# EAGLE design schematic (EAGLE 9.6.2)
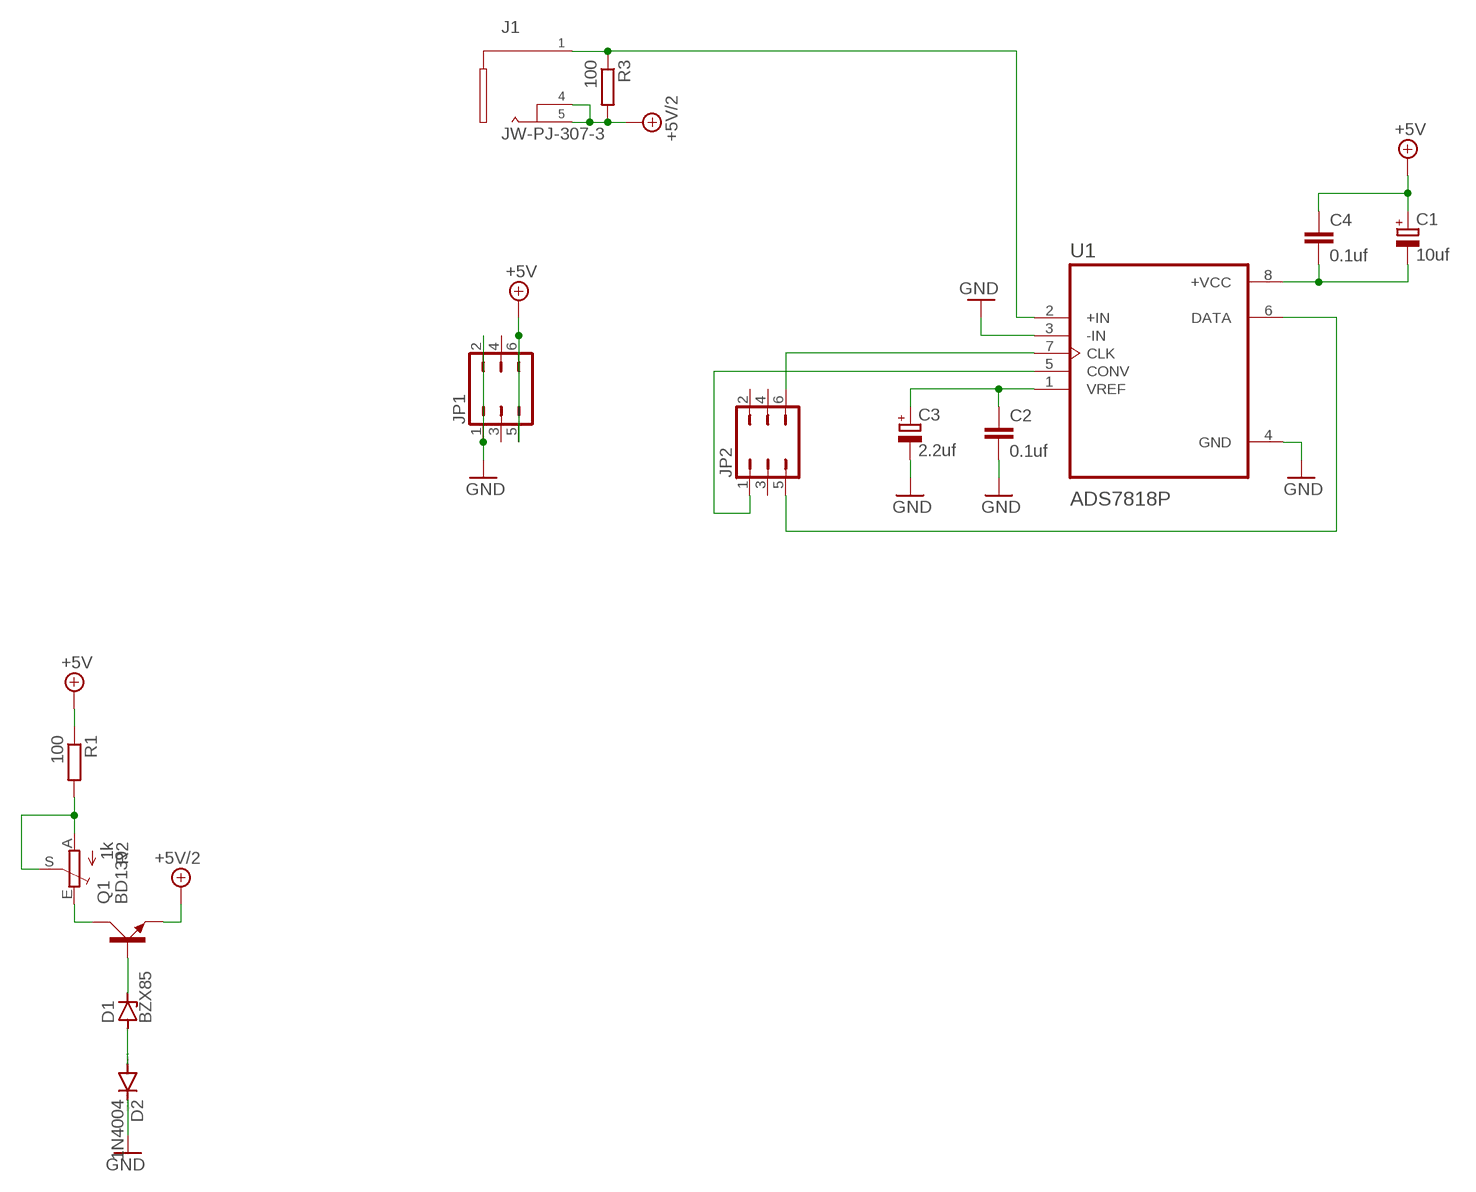
[diagram p0: schematic, sheet 1]

## Parts
C1  10uf  CPOL-EUE3.5-8  [E3,5-8]
C2  0.1uf  C-EU050-030X075  [C050-030X075]
C3  2.2uf  CPOL-EUE2.5-6  [E2,5-6]
C4  0.1uf  C-EU050-030X075  [C050-030X075]
D1  BZX85  [DO41Z10]
D2  1N4004  [DO41-10]
J1  JW-PJ-307-3  [JW-PJ-307-X]
JP1  JP3Q  [JP3Q]
JP2  JP3Q  [JP3Q]
Q1  BD139  [TO126AV]
R1  100  R-EU_0207/10  [0207/10]
R2  1k  TRIM_EU-CA9V  [CA9V]
R3  100  R-EU_0207/10  [0207/10]
U1  ADS7818P  [DIP794W45P254L959H508Q8]

## Nets
+5V: C1.+ C4.1 JP1.5 JP1.6 R1.1
+5V/2: J1.P$4 J1.P$5 Q1.E R3.2
GND: C2.2 C3.- D2.C JP1.1 JP1.2 U1.3(-IN) U1.4(GND)
N$1: R1.2 R2.A R2.S
N$2: D1.A D2.A
N$3: D1.C Q1.B
N$4: Q1.C R2.E
N$5: JP2.6 U1.7(CLK)
N$6: J1.P$1 R3.1 U1.2(+IN)
N$7: JP2.1 U1.5(CONV)
N$8: C2.1 C3.+ U1.1(VREF)
N$9: JP2.5 U1.6(DATA)
N$10: C1.- C4.2 U1.8(+VCC)
Unconnected: JP1.3 JP1.4 JP2.2 JP2.3 JP2.4

## Library data of the parts
C1 C3 = rcl:CPOL-EU: POLARIZED CAPACITOR, European symbol; SPICEPREFIX: C
C2 C4 = rcl:C-EU: CAPACITOR, European symbol; SPICEPREFIX: C
D1 = diode:BZX85: Z DIODE
D2 = diode:1N4004: DIODE general purpose rectifier, 1 A
J1 = audioconn:JW-PJ-307-3
JP1 JP2 = jumper:JP3Q: JUMPER
Q1 = transistor-power:BD139: NPN TRANSISTOR
R1 R3 = rcl:R-EU_: RESISTOR, European symbol; SPICEPREFIX: R
R2 = pot:TRIM_EU-: POTENTIOMETER
U1 = ADS7818P:ADS7818P: Check prices <https://pricing.snapeda.com/parts/ADS7818P/Texas%20Instruments/view-part?ref=eda>; AVAILABILITY: Warning; DESCRIPTION: 12-Bit High Speed Low Power Sampling Analog-to-Digital Converter; MF: Texas Instruments; MP: ADS7818P; PACKAGE: PDIP-8 Texas; PRICE: None; PURCHASE-URL: https://pricing.snapeda.com/search/part/ADS7818P/?ref=eda

## Board
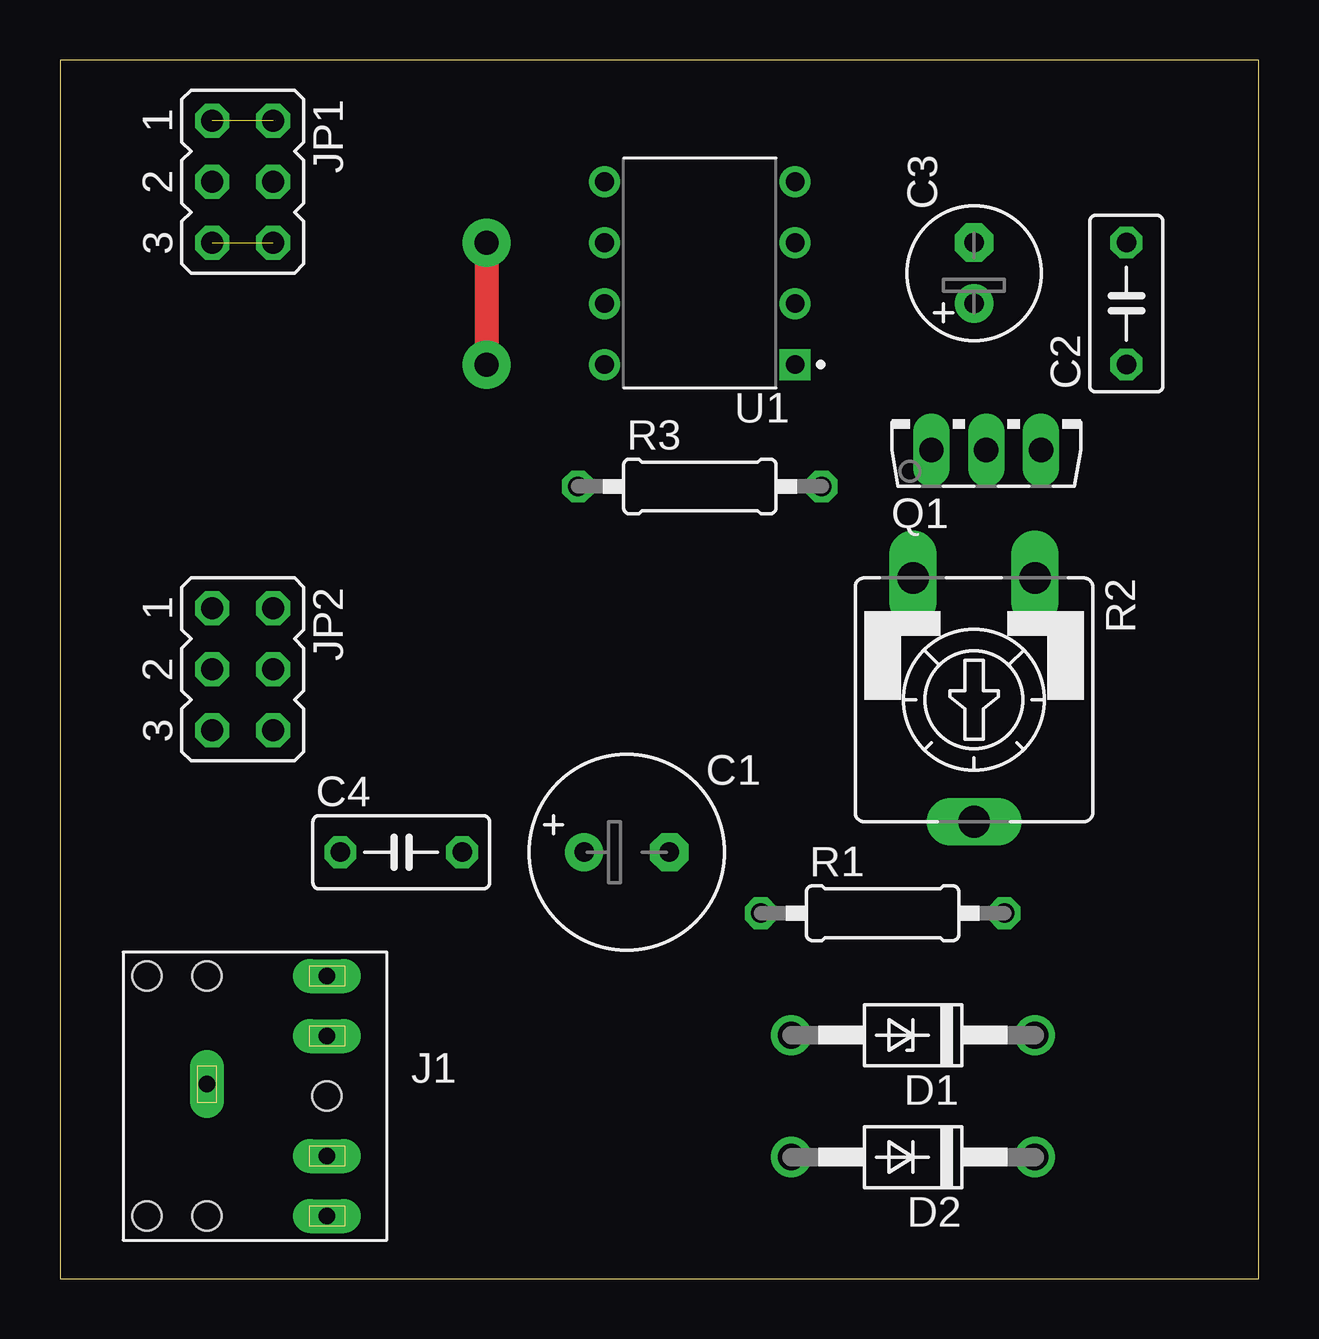
[diagram p1: board, top side]
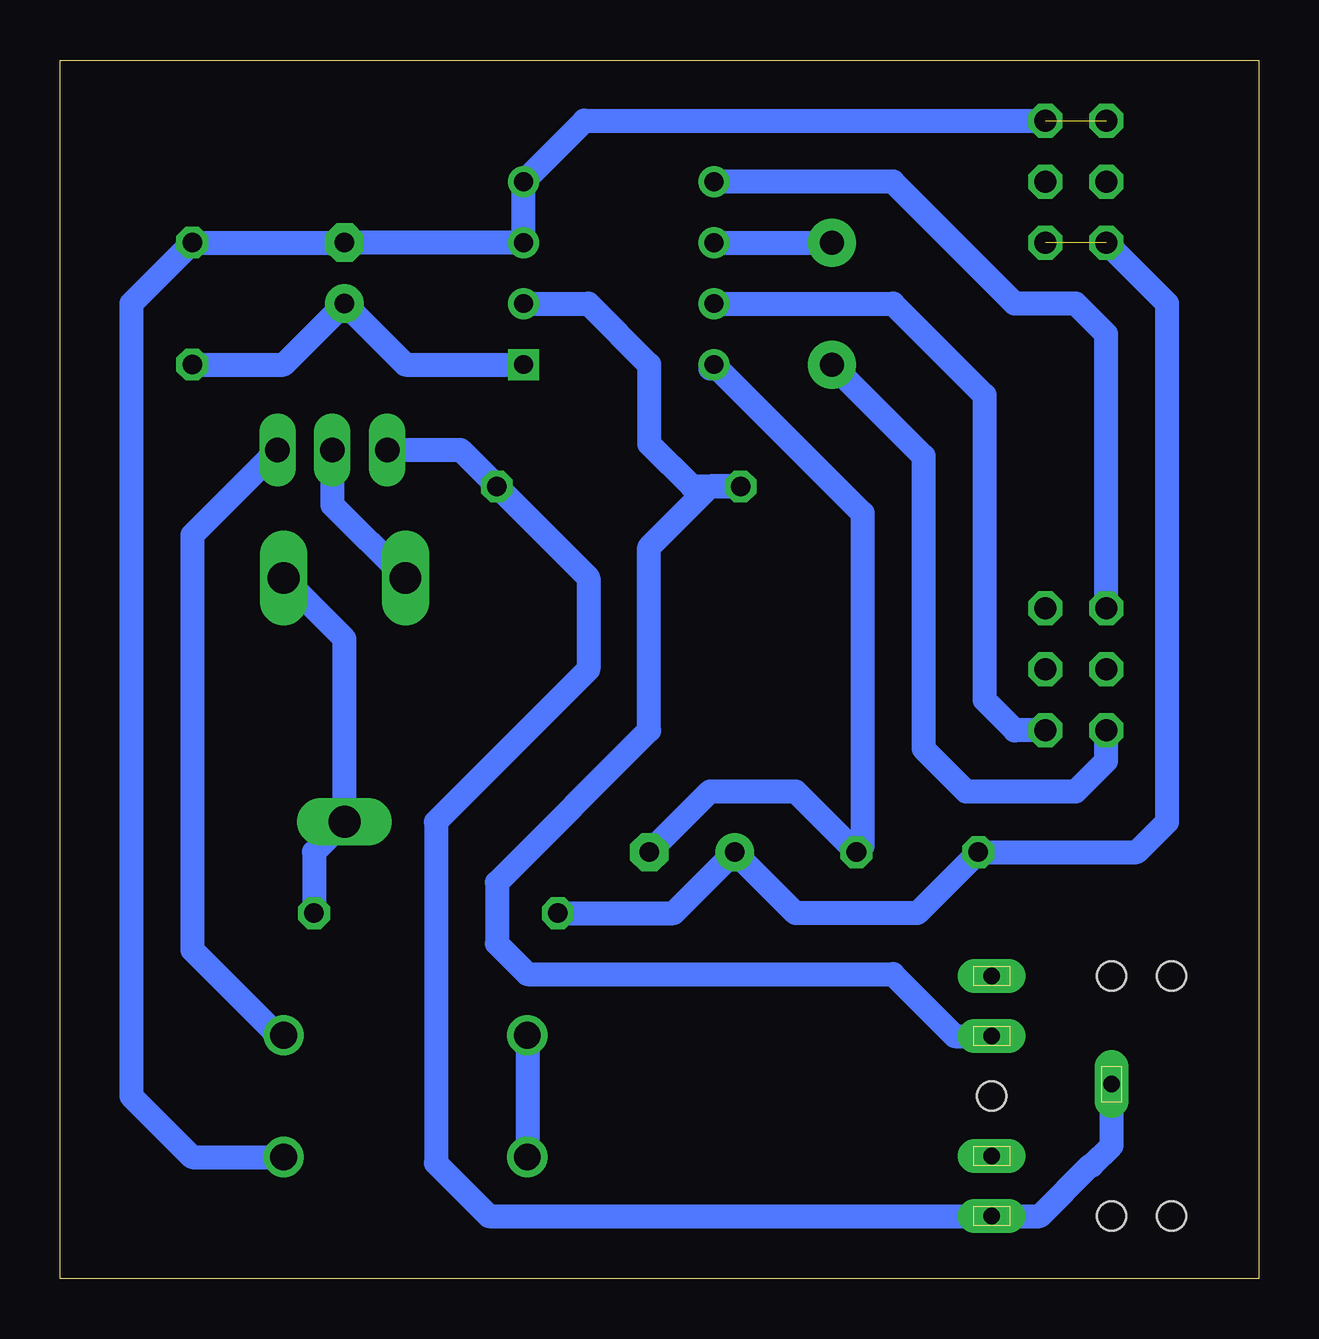
[diagram p2: board, bottom side, seen from below]

Size 49.96 x 50.79 mm. Coordinates in mm from the lower left corner, seen from the top.
Outline: 0,0 49.96,0 49.96,50.79 0,50.79 0,0
Copper layers (1*16): Top 0.035mm / dielectric 1.5mm / Bottom 0.035mm
Design rules "default": minimum track width 6mil, minimum drill 0.35mm, track to track 6mil, track to pad 6mil, pad to pad 6mil, via to via 6mil, smd to smd 6mil, copper to edge 40mil, drill to drill 6mil, minimum pad ring 10mil, minimum via ring 8mil, stop-mask expansion 4mil, vias tented up to drill 0mil, thermal gap 10mil

### Footprints (pad centres in the part's own frame; a part is rotated, then mirrored left to right if it is on the bottom)
E3,5-8 = drill 0.813 pad 1.6: + -1.778,0 | drill 0.813 pad 1.6 octagon: - 1.778,0
C050-030X075 = drill 0.813 octagon: 1 -2.54,0; 2 2.54,0
E2,5-6 = drill 0.813 pad 1.6: + -1.27,0 | drill 0.813 pad 1.6 octagon: - 1.27,0
DO41Z10 = drill 1.118: A 5.08,0; C -5.08,0
DO41-10 = drill 1.118: A 5.08,0; C -5.08,0
JW-PJ-307-X = drill 0.7 pad 1.422 long: P$1 3,2.5; P$2 3,5; P$3 3,-2.5; P$4 3,-5; P$5 -2,0.5 | hole 1.2: -4.5,5; -2,5; 3,0; -4.5,-5; -2,-5
JP3Q = drill 0.914 octagon: 1 -2.54,-1.27; 2 -2.54,1.27; 3 0,-1.27; 4 0,1.27; 5 2.54,-1.27; 6 2.54,1.27
TO126AV = drill 1.016 long: B 2.286,-1.27; C 0,-1.27; E -2.286,-1.27
0207/10 = drill 0.813 octagon: 1 -5.08,0; 2 5.08,0
CA9V = drill 1.321 long: A -2.54,-5.08; E 2.54,-5.08; S 0,5.08
DIP794W45P254L959H508Q8 = drill 0.78 pad 1.13 square: 1 -3.97,3.81 | drill 0.78 pad 1.13: 2 -3.97,1.27; 3 -3.97,-1.27; 4 -3.97,-3.81; 5 3.97,-3.81; 6 3.97,-1.27; 7 3.97,1.27; 8 3.97,3.81

### Placement (x,y rotation side)
C1  23.62,17.78 0 top
C2  44.45,40.64 90 top
C3  38.1,41.91 90 top
C4  14.22,17.78 0 top
D1  35.56,10.16 180 top
D2  35.56,5.08 180 top
J1  8.13,7.62 0 top
JP1  7.62,45.72 270 top
JP2  7.62,25.4 270 top
Q1  38.61,35.81 0 top
R1  34.29,15.24 0 top
R2  38.1,24.13 180 top
R3  26.67,33.02 0 top
U1  26.67,41.91 180 top

### Tracks (layer width: path | path; a pad name or v marks a point on that pad's centre or on a via)
+5V  (1 unrouted)
  Bottom 1: JP1.5 3.81,40.64 3.81,19.05 5.08,17.78 C4.1 14.22,15.24 19.3,15.24 C1.+ 24.38,15.24 R1.1
+5V/2
  Bottom 1: Q1.E 33.27,34.54 R3.2 27.94,29.21 27.94,25.4 34.29,19.05 34.29,4.83 32.08,2.62 J1.P$4 9.12,2.62 7,4.74 6.95,4.74 6.13,5.56 J1.P$5
GND  (1 unrouted)
  Bottom 1: JP1.2 28.1,48.26 U1.4 U1.3 C3.- C2.2 46.99,40.64 46.99,7.62 44.45,5.08 D2.C
N$1
  Bottom 1: R2.S 37.85,19.3 | R2.S 39.37,17.78 R1.2 | R2.S 38.1,26.67 R2.A
N$2
  Bottom 1: D1.A D2.A
N$3
  Bottom 1: Q1.B 44.45,30.99 44.45,13.72 40.89,10.16 D1.C
N$4
  Bottom 1: Q1.C 38.61,32.26 R2.E
N$5
  Bottom 1: U1.7 15.24,40.64 11.43,36.83 11.43,24.13 10.16,22.86 JP2.6
N$6
  Bottom 1: U1.2 27.94,40.64 25.4,38.1 25.4,34.8 23.62,33.02 R3.1 22.86,33.02 25.4,30.48 25.4,22.86 31.75,16.51 31.75,13.97 30.48,12.7 15.24,12.7 12.66,10.12 J1.P$1
N$7
  Bottom 1: JP2.1 6.35,39.37 7.62,40.64 10.16,40.64 15.24,45.72 U1.5
N$8
  Bottom 1: U1.1 35.56,38.1 C3.+ 40.64,38.1 C2.1
N$9  (via drill 1 pad 2)
  Top 1: v17.78,43.18 v17.78,38.1
  Bottom 1: U1.6 v17.78,43.18 | v17.78,38.1 13.97,34.29 13.97,22.1 12.19,20.32 7.62,20.32 6.35,21.59 JP2.5
N$10
  Bottom 1: 22.86,37.94 U1.8 16.51,31.91 16.51,18.03 C4.2 19.3,20.32 22.86,20.32 C1.-